# EAGLE design Esquemático_ppg (EAGLE 9.6.2)
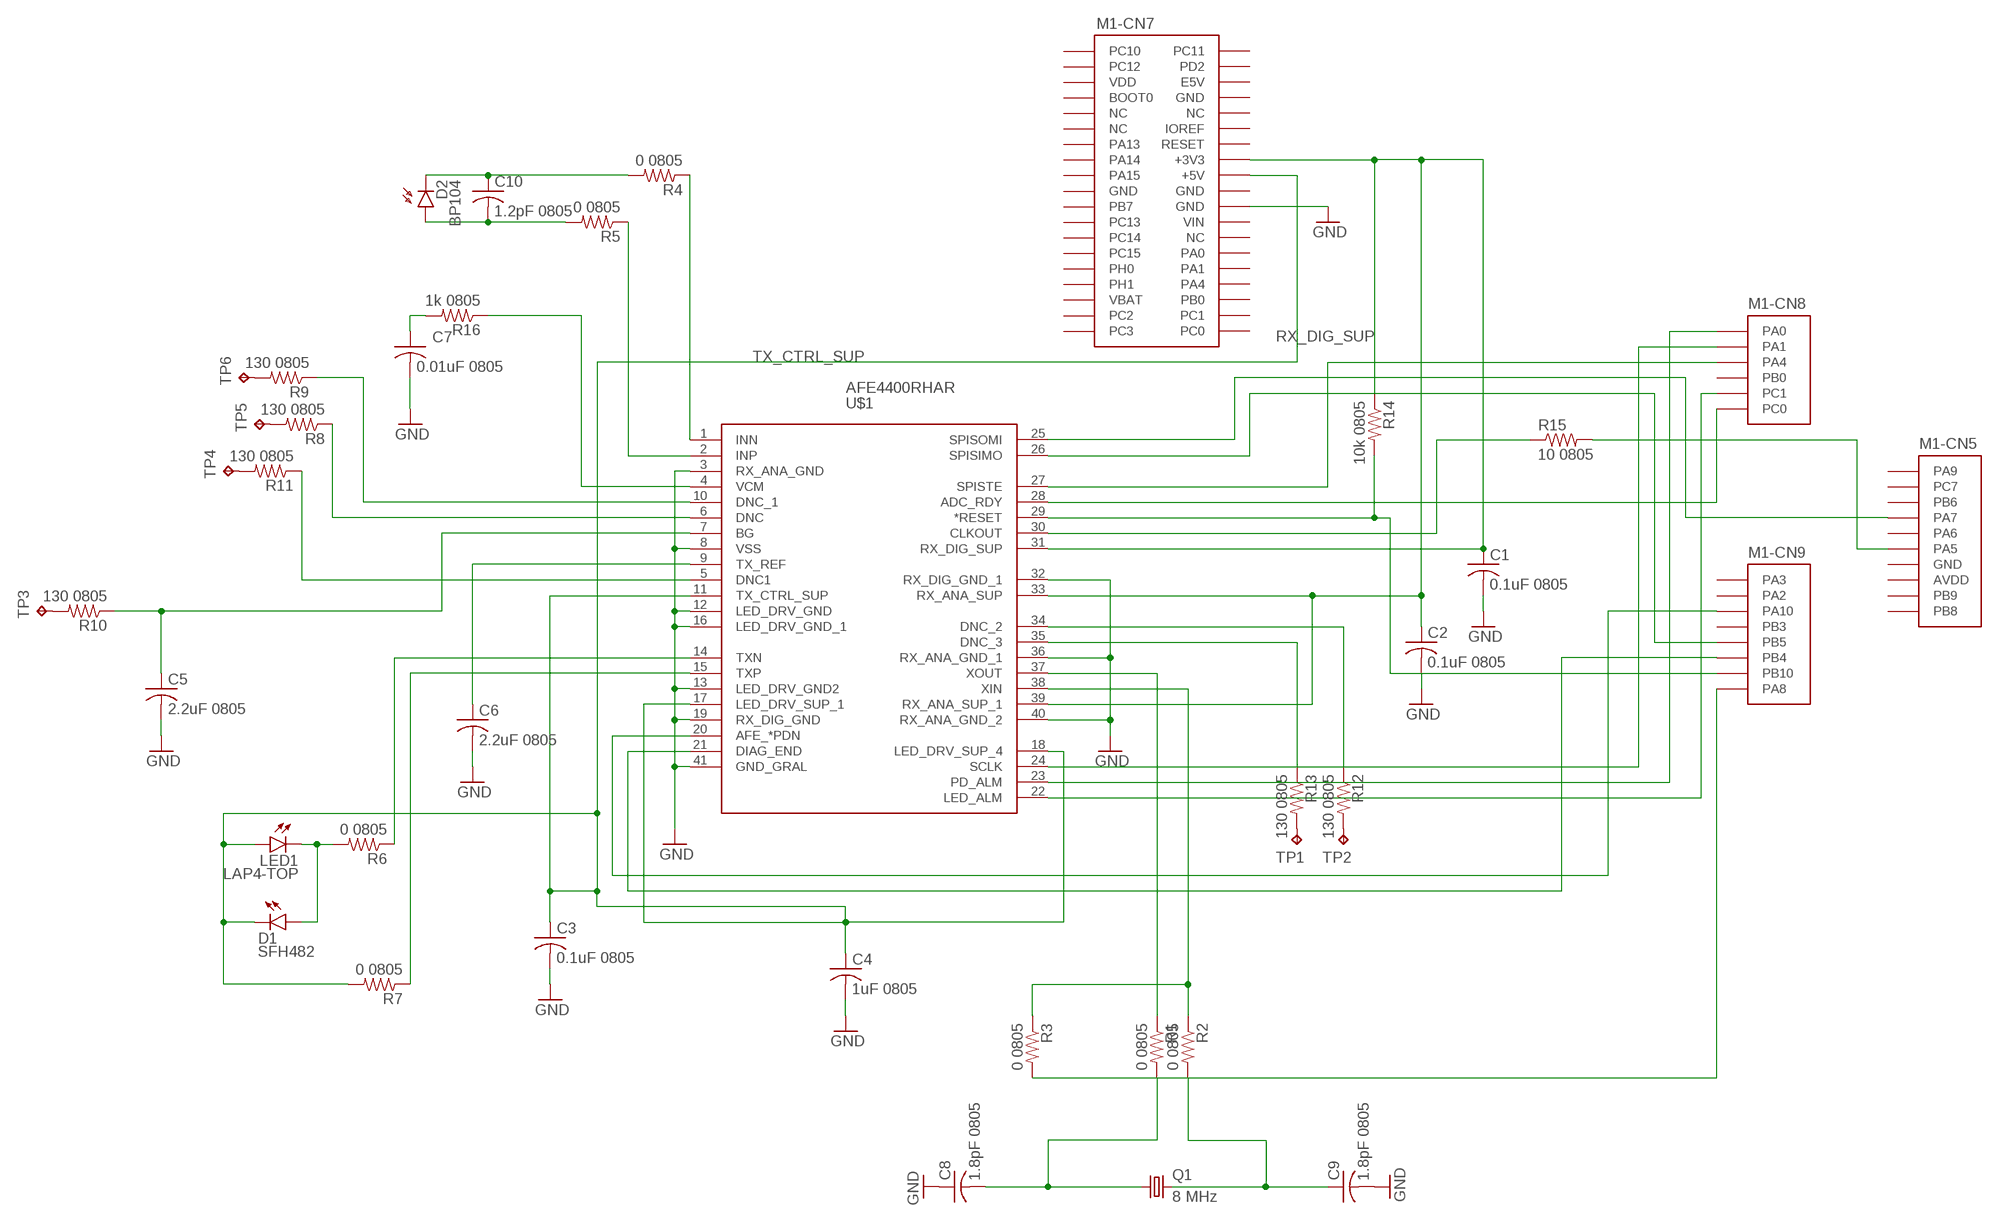
[diagram p0: schematic, sheet 1]

## Parts
C1  0.1uF 0805  C-USC0805  [C0805]
C2  0.1uF 0805  C-USC0805  [C0805]
C3  0.1uF 0805  C-USC0805  [C0805]
C4  1uF 0805  C-USC0805  [C0805]
C5  2.2uF 0805  C-USC0805  [C0805]
C6  2.2uF 0805  C-USC0805  [C0805]
C7  0.01uF 0805  C-USC0805  [C0805]
C8  1.8pF 0805  C-USC0805  [C0805]
C9  1.8pF 0805  C-USC0805  [C0805]
C10  1.2pF 0805  C-USC0805  [C0805]
D1  SFH482  [SFH482]
D2  BP104  [BP104]
LED1  LAP4-TOP  [P47F-TOP]
M1  NUCLEO-L452RE  [NUCLEO-64]
Q1  8 MHz  CRYSTALSM49  [SM49]
R1  0 0805  R-US_M0805  [M0805]
R2  0 0805  R-US_M0805  [M0805]
R3  0 0805  R-US_M0805  [M0805]
R4  0 0805  R-US_M0805  [M0805]
R5  0 0805  R-US_M0805  [M0805]
R6  0 0805  R-US_M0805  [M0805]
R7  0 0805  R-US_M0805  [M0805]
R8  130 0805  R-US_M0805  [M0805]
R9  130 0805  R-US_M0805  [M0805]
R10  130 0805  R-US_M0805  [M0805]
R11  130 0805  R-US_M0805  [M0805]
R12  130 0805  R-US_M0805  [M0805]
R13  130 0805  R-US_M0805  [M0805]
R14  10k 0805  R-US_M0805  [M0805]
R15  10 0805  R-US_M0805  [M0805]
R16  1k 0805  R-US_M0805  [M0805]
TP1  TPB1,27  [B1,27]
TP2  TPB1,27  [B1,27]
TP3  TPB1,27  [B1,27]
TP4  TPB1,27  [B1,27]
TP5  TPB1,27  [B1,27]
TP6  TPB1,27  [B1,27]
U$1  AFE4400RHAR  AFE4400  [40-VQFN(6X6)]

## Nets
GND: C1.2 C2.2 C3.2 C4.2 C5.2 C6.2 C7.2 C8.1 C9.2 M1.CN7-22(-CN7:GND) U$1.3(RX_ANA_GND) U$1.8(VSS) U$1.12(LED_DRV_GND) U$1.13(LED_DRV_GND2) U$1.16(LED_DRV_GND_1) U$1.19(RX_DIG_GND) U$1.32(RX_DIG_GND_1) U$1.36(RX_ANA_GND_1) U$1.40(RX_ANA_GND_2) U$1.41(GND_GRAL)
N$1: R4.1 U$1.1(INN)
N$2: R5.1 U$1.2(INP)
N$3: R6.1 U$1.14(TXN)
N$4: R7.1 U$1.15(TXP)
N$5: R2.1 R3.1 U$1.38(XIN)
N$6: R1.1 U$1.37(XOUT)
N$7: R13.2 TP1.TP
N$8: R12.2 TP2.TP
N$9: R10.2 TP3.TP
N$10: R11.1 U$1.5(DNC1)
N$11: R12.1 U$1.34(DNC_2)
N$12: R11.2 TP4.TP
N$13: R9.1 U$1.10(DNC_1)
N$14: R8.1 U$1.6(DNC)
N$15: C5.1 R10.1 U$1.7(BG)
N$16: R13.1 U$1.35(DNC_3)
N$17: M1.CN9-7(-CN9:PB10) R14.2 U$1.29(*RESET)
N$18: R8.2 TP5.TP
N$19: R15.1 U$1.30(CLKOUT)
N$20: M1.CN5-6(-CN5:PA5) R15.2
N$21: M1.CN9-8(-CN9:PA8) R3.2
N$22: M1.CN8-3(-CN8:PA4) U$1.27(SPISTE)
N$23: C6.1 U$1.9(TX_REF)
N$24: M1.CN9-5(-CN9:PB5) U$1.26(SPISIMO)
N$25: R16.1 U$1.4(VCM)
N$26: C7.1 R16.2
N$27: C8.2 Q1.1 R1.2
N$28: C9.1 Q1.2 R2.2
N$29: M1.CN5-4(-CN5:PA7) U$1.25(SPISOMI)
N$30: M1.CN8-1(-CN8:PA0) U$1.23(PD_ALM)
N$31: M1.CN8-5(-CN8:PC1) U$1.22(LED_ALM)
N$32: M1.CN8-6(-CN8:PC0) U$1.28(ADC_RDY)
N$33: M1.CN9-3(-CN9:PA10) U$1.20(AFE_*PDN)
N$34: M1.CN9-6(-CN9:PB4) U$1.21(DIAG_END)
N$35: D1.A LED1.C R6.2
N$36: R9.2 TP6.TP
N$37: C10.2 D2.A R5.2
N$38: C10.1 D2.K(C) R4.2
RX_DIG_SUP: C1.1 C2.1 M1.CN7-16(-CN7:+3V3) R14.1 U$1.31(RX_DIG_SUP) U$1.33(RX_ANA_SUP) U$1.39(RX_ANA_SUP_1)
SCLK: M1.CN8-2(-CN8:PA1) U$1.24(SCLK)
TX_CTRL_SUP: C3.1 C4.1 D1.K(C) LED1.A M1.CN7-18(-CN7:+5V) R7.2 U$1.11(TX_CTRL_SUP) U$1.17(LED_DRV_SUP_1) U$1.18(LED_DRV_SUP_4)
Unconnected: M1.CN5-1(-CN5:PA9) M1.CN5-2(-CN5:PC7) M1.CN5-3(-CN5:PB6) M1.CN5-5(-CN5:PA6) M1.CN5-9(-CN5:PB9) M1.CN5-10(-CN5:PB8) M1.CN6-1(-CN6:NC) M1.CN6-3(-CN6:RESET) M1.CN7-1(-CN7:PC10) M1.CN7-2(-CN7:PC11) M1.CN7-3(-CN7:PC12) M1.CN7-4(-CN7:PD2) M1.CN7-6(-CN7:E5V) M1.CN7-7(-CN7:BOOT0) M1.CN7-9(-CN7:NC) M1.CN7-10(-CN7:NC) M1.CN7-11(-CN7:NC) M1.CN7-12(-CN7:IOREF) M1.CN7-13(-CN7:PA13) M1.CN7-14(-CN7:RESET) M1.CN7-15(-CN7:PA14) M1.CN7-17(-CN7:PA15) M1.CN7-21(-CN7:PB7) M1.CN7-23(-CN7:PC13) M1.CN7-25(-CN7:PC14) M1.CN7-26(-CN7:NC) M1.CN7-27(-CN7:PC15) M1.CN7-28(-CN7:PA0) M1.CN7-29(-CN7:PH0) M1.CN7-30(-CN7:PA1) M1.CN7-31(-CN7:PH1) M1.CN7-32(-CN7:PA4) M1.CN7-34(-CN7:PB0) M1.CN7-35(-CN7:PC2) M1.CN7-36(-CN7:PC1) M1.CN7-37(-CN7:PC3) M1.CN7-38(-CN7:PC0) M1.CN8-4(-CN8:PB0) M1.CN9-1(-CN9:PA3) M1.CN9-2(-CN9:PA2) M1.CN9-4(-CN9:PB3) M1.CN10-1(-CN10:PC9) M1.CN10-2(-CN10:PC8) M1.CN10-3(-CN10:PB8) M1.CN10-4(-CN10:PC6) M1.CN10-5(-CN10:PB9) M1.CN10-6(-CN10:PC5) M1.CN10-10(-CN10:NC) M1.CN10-11(-CN10:PA5) M1.CN10-12(-CN10:PA12) M1.CN10-13(-CN10:PA6) M1.CN10-14(-CN10:PA11) M1.CN10-15(-CN10:PA7) M1.CN10-16(-CN10:PB12) M1.CN10-17(-CN10:PB6) M1.CN10-18(-CN10:PB11) M1.CN10-19(-CN10:PC7) M1.CN10-21(-CN10:PA9) M1.CN10-22(-CN10:PB2) M1.CN10-23(-CN10:PA8) M1.CN10-24(-CN10:PB1) M1.CN10-25(-CN10:PB10) M1.CN10-26(-CN10:PB15) M1.CN10-27(-CN10:PB4) M1.CN10-28(-CN10:PB14) M1.CN10-29(-CN10:PB5) M1.CN10-30(-CN10:PB13) M1.CN10-31(-CN10:PB3) M1.CN10-33(-CN10:PA10) M1.CN10-34(-CN10:PC4) M1.CN10-35(-CN10:PA2) M1.CN10-36(-CN10:NC) M1.CN10-37(-CN10:PA3) M1.CN10-38(-CN10:NC)

## Power pins joined to a net without a drawn wire
+3V3: M1.CN6-4(-CN6:+3V3)
+5V: M1.CN6-5(-CN6:+5V)
AGND: M1.CN10-32(-CN10:AGND)
AVDD: M1.CN5-8(-CN5:AVDD) M1.CN10-7(-CN10:AVDD)
GND: M1.CN5-7(-CN5:GND) M1.CN6-6(-CN6:GND) M1.CN6-7(-CN6:GND) M1.CN7-8(-CN7:GND) M1.CN7-19(-CN7:GND) M1.CN7-20(-CN7:GND) M1.CN10-9(-CN10:GND) M1.CN10-20(-CN10:GND)
IOREF: M1.CN6-2(-CN6:IOREF)
U5V: M1.CN10-8(-CN10:U5V)
VBAT: M1.CN7-33(-CN7:VBAT)
VDD: M1.CN7-5(-CN7:VDD)
VIN: M1.CN6-8(-CN6:VIN) M1.CN7-24(-CN7:VIN)

## Library data of the parts
C1-C4 = rcl:C-US: CAPACITOR, American symbol; PARTNO: GRM188R72A104KA35J; SPICEPREFIX: C
C5 C6 = rcl:C-US: CAPACITOR, American symbol; PARTNO: GRM21BR71E225KE11L; SPICEPREFIX: C
C7 = rcl:C-US: CAPACITOR, American symbol; PARTNO: GRM2195C1H103JA01D; SPICEPREFIX: C
C8 C9 = rcl:C-US: CAPACITOR, American symbol; PARTNO: 600F180FT250XT; SPICEPREFIX: C
C10 = rcl:C-US: CAPACITOR, American symbol; PARTNO: GQM2195C2E1R2BB12D; SPICEPREFIX: C
D1 = led:SFH482: IR LED infrared emitting diode, Infineon; PARTNO: SCM-013RT
D2 = opto-trans-siemens:BP104: PHOTO DIODE; MF: VISHAY/TELEFUNKEN; MPN: BP104; OC_FARNELL: 1779636; OC_NEWARK: 14M4504; PARTNO: VEMD2020X01
LED1 = led:*P4: PointLED® Enhanced Thinfilm LED TOP & BOTTOM mount LS P47F, LR P47F, LA P47F, LY P47F, LT P4SG, LB P4SG, LW P4SG Source: http://catalog.osram-os.com .. LA_LR_LS_LY_P47F_Pb_free.pdf; PARTNO: HLMP-K150
M1 = NUCLEO-L452RE:NUCLEO-L452RE: No existe un outline (Layer Dimension) para esta librería. En su lugar se utilizó una referencia en tDocu. Al momento de diseñar la tarjeta, el Dimension debe ser dibujado según los requerimientos del usuario, o simplemente copiar los contenidos del tDocu en Dimensions.
Q1 = crystal:CRYSTAL: CRYSTAL; OC_FARNELL: unknown; OC_NEWARK: unknown; PARTNO: ABLS-8.000MHZ-B4-T
R1-R7 = rcl:R-US_: RESISTOR, American symbol; PARTNO: RMCF0805ZT0R00; SPICEPREFIX: R
R8-R13 = rcl:R-US_: RESISTOR, American symbol; PARTNO: RMCF0805FT130R; SPICEPREFIX: R
R14 = rcl:R-US_: RESISTOR, American symbol; PARTNO: RC0805FR-1010KL; SPICEPREFIX: R
R15 = rcl:R-US_: RESISTOR, American symbol; PARTNO: RC0805FR-0710RL; SPICEPREFIX: R
R16 = rcl:R-US_: RESISTOR, American symbol; PARTNO: RMCF0805FT1K00; SPICEPREFIX: R
TP1-TP6 = testpad:TP: Test pad
U$1 = AFE4400RHAR - TI:AFE4400

## Board
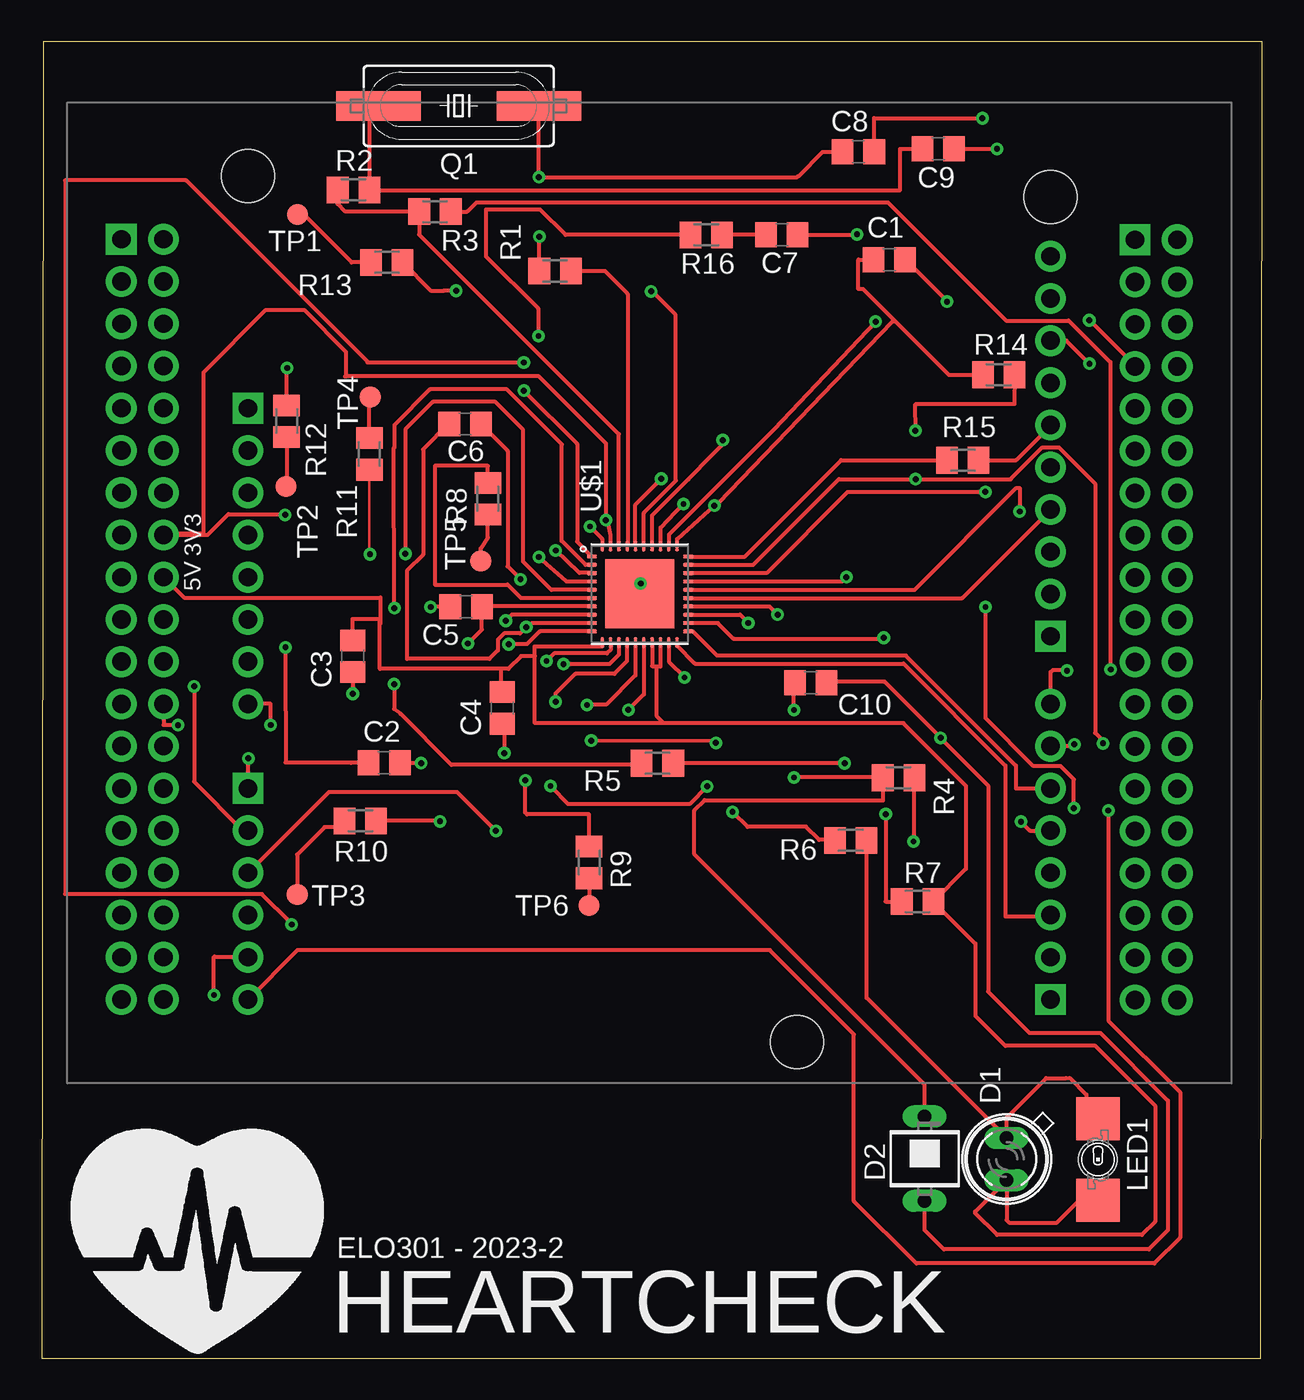
[diagram p1: board, top side]
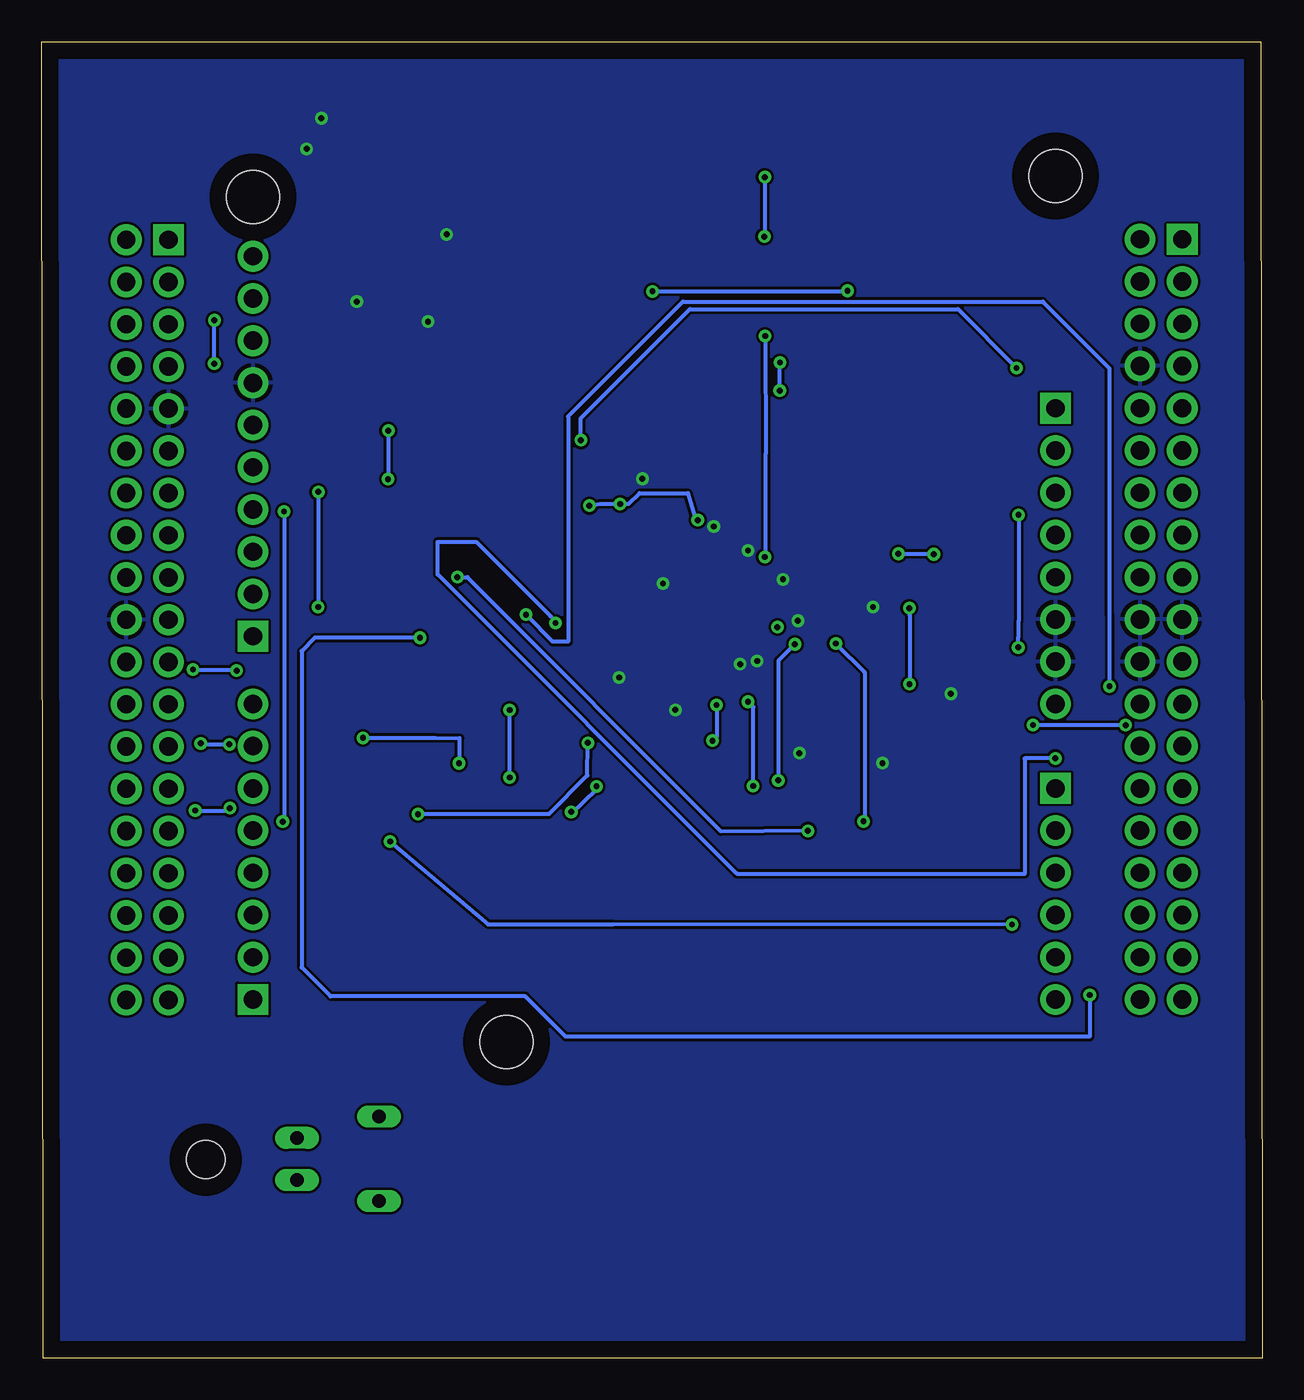
[diagram p2: board, bottom side, seen from below]

Size 73.4 x 79.19 mm. Coordinates in mm from the lower left corner, seen from the top.
Outline: 0,0 73.31,0.03 73.4,79.19 0.09,79.17 0,0
Copper layers (1*16): Top 0.035mm / dielectric 1.5mm / Bottom 0.035mm
Design rules "default *": minimum track width 6mil, minimum drill 0.3mm, track to track 6mil, track to pad 6mil, pad to pad 6mil, via to via 6mil, smd to smd 6mil, copper to edge 40mil, drill to drill 6mil, minimum pad ring 10mil, minimum via ring 8mil, stop-mask expansion 2mil, vias tented up to drill 0.5mm, thermal gap 10mil

### Footprints (pad centres in the part's own frame; a part is rotated, then mirrored left to right if it is on the bottom)
C0805 = smd 1.3 x 1.5: 1 -0.95,0; 2 0.95,0
SFH482 = drill 0.813 long: A -1.27,0; K 1.27,0
BP104 = drill 0.813 long: A 0,2.54; K 0,-2.54
P47F-TOP = smd 2.6 x 2.6: A -2.45,0; C 2.45,0 | hole 2.3: 0,0
NUCLEO-64 = drill 1.1 pad 1.85 square: CN5-1 59.13,24.884; CN6-1 10.87,38.6; CN7-1 3.25,48.76; CN8-1 10.87,15.74; CN9-1 59.13,3.04; CN10-1 64.21,48.735 | drill 1.1 pad 1.85: CN5-2 59.13,27.424; CN5-3 59.13,29.964; CN5-4 59.13,32.504; CN5-5 59.13,35.044; CN5-6 59.13,37.584; CN5-7 59.13,40.124; CN5-8 59.13,42.664; CN5-9 59.13,45.204; CN5-10 59.13,47.744; CN6-2 10.87,36.06; CN6-3 10.87,33.52; CN6-4 10.87,30.98; CN6-5 10.87,28.44; CN6-6 10.87,25.9; CN6-7 10.87,23.36; CN6-8 10.87,20.82; CN7-2 5.79,48.76; CN7-3 3.25,46.22; CN7-4 5.79,46.22; CN7-5 3.25,43.68; CN7-6 5.79,43.68; CN7-7 3.25,41.14; CN7-8 5.79,41.14; CN7-9 3.25,38.6; CN7-10 5.79,38.6; CN7-11 3.25,36.06; CN7-12 5.79,36.06; CN7-13 3.25,33.52; CN7-14 5.79,33.52; CN7-15 3.25,30.98; CN7-16 5.79,30.98; CN7-17 3.25,28.44; CN7-18 5.79,28.44; CN7-19 3.25,25.9; CN7-20 5.79,25.9; CN7-21 3.25,23.36; CN7-22 5.79,23.36; CN7-23 3.25,20.82; CN7-24 5.79,20.82; CN7-25 3.25,18.28; CN7-26 5.79,18.28; CN7-27 3.25,15.74; CN7-28 5.79,15.74; CN7-29 3.25,13.2; CN7-30 5.79,13.2; CN7-31 3.25,10.66; CN7-32 5.79,10.66; CN7-33 3.25,8.12; CN7-34 5.79,8.12; CN7-35 3.25,5.58; CN7-36 5.79,5.58; CN7-37 3.25,3.04; CN7-38 5.79,3.04; CN8-2 10.87,13.2; CN8-3 10.87,10.66; CN8-4 10.87,8.12; CN8-5 10.87,5.58; CN8-6 10.87,3.04; CN9-2 59.13,5.58; CN9-3 59.13,8.12; CN9-4 59.13,10.66; CN9-5 59.13,13.2; CN9-6 59.13,15.74; CN9-7 59.13,18.28; CN9-8 59.13,20.82; CN10-2 66.75,48.735; CN10-3 64.21,46.195; CN10-4 66.75,46.195; CN10-5 64.21,43.655; CN10-6 66.75,43.655; CN10-7 64.21,41.115; CN10-8 66.75,41.115; CN10-9 64.21,38.575; CN10-10 66.75,38.575; CN10-11 64.21,36.035; CN10-12 66.75,36.035; CN10-13 64.21,33.495; CN10-14 66.75,33.495; CN10-15 64.21,30.955; CN10-16 66.75,30.955; CN10-17 64.21,28.415; CN10-18 66.75,28.415; CN10-19 64.21,25.875; CN10-20 66.75,25.875; CN10-21 64.21,23.335; CN10-22 66.75,23.335; CN10-23 64.21,20.795; CN10-24 66.75,20.795; CN10-25 64.21,18.255; CN10-26 66.75,18.255; CN10-27 64.21,15.715; CN10-28 66.75,15.715; CN10-29 64.21,13.175; CN10-30 66.75,13.175; CN10-31 64.21,10.635; CN10-32 66.75,10.635; CN10-33 64.21,8.095; CN10-34 66.75,8.095; CN10-35 64.21,5.555; CN10-36 66.75,5.555; CN10-37 64.21,3.015; CN10-38 66.75,3.015 | hole 3.175: 59.13,51.3; 10.87,52.57; 43.89,0.5
SM49 = smd 5.08 x 1.778: 1 -4.826,0; 2 4.826,0
M0805 = smd 1.3 x 1.6: 1 -0.95,0; 2 0.95,0
B1,27 = smd 1.27 x 1.27: TP 0,0
40-VQFN(6X6) = smd 0.6 x 0.22: 1 -2.875,2.25; 2 -2.875,1.75; 3 -2.875,1.25; 4 -2.875,0.75; 5 -2.875,0.25; 6 -2.875,-0.25; 7 -2.875,-0.75; 8 -2.875,-1.25; 9 -2.875,-1.75; 10 -2.875,-2.25; 21 2.925,-2.25; 22 2.925,-1.75; 23 2.925,-1.25; 24 2.925,-0.75; 25 2.925,-0.25; 26 2.925,0.25; 27 2.925,0.75; 28 2.925,1.25; 29 2.925,1.75; 30 2.925,2.25 | smd 0.22 x 0.6: 11 -2.25,-2.925; 12 -1.75,-2.925; 13 -1.25,-2.925; 14 -0.75,-2.925; 15 -0.25,-2.925; 16 0.25,-2.925; 17 0.75,-2.925; 18 1.25,-2.925; 19 1.75,-2.925; 20 2.25,-2.925; 31 2.25,2.875; 32 1.75,2.875; 33 1.25,2.875; 34 0.75,2.875; 35 0.25,2.875; 36 -0.25,2.875; 37 -0.75,2.875; 38 -1.25,2.875; 39 -1.75,2.875; 40 -2.25,2.875 | smd 4.15 x 4.15: 41 0,0

### Placement (x,y rotation side)
C1  50.98,66.07 0 top
C2  20.6,35.81 0 top
C3  18.71,42.23 270 top
C4  27.71,39.12 270 top
C5  25.53,45.22 180 top
C6  25.47,56.19 0 top
C7  44.52,67.58 0 top
C8  49.12,72.55 180 top
C9  53.92,72.73 0 top
C10  46.25,40.64 0 top
D1  58.04,11.99 270 top
D2  53.11,12.01 180 top
LED1  63.53,11.96 90 top
M1  1.55,18.54 0 top
Q1  25.08,75.32 180 top
R1  30.88,65.4 180 top
R2  18.76,70.27 0 top
R3  23.66,68.97 0 top
R4  51.54,34.92 180 top
R5  37.04,35.79 0 top
R6  48.66,31.15 0 top
R7  52.68,27.48 0 top
R8  26.84,51.7 270 top
R9  32.93,29.83 270 top
R10  19.17,32.33 180 top
R11  19.72,54.39 90 top
R12  14.74,56.36 270 top
R13  20.77,65.91 180 top
R14  57.56,59.15 0 top
R15  55.4,54.01 0 top
R16  39.97,67.56 0 top
TP1  15.4,68.8 0 top
TP2  14.71,52.43 0 top
TP3  15.38,27.89 0 top
TP4  19.77,57.81 0 top
TP5  26.41,47.95 270 top
TP6  32.92,27.23 0 top
U$1  35.97,45.97 0 top

### Tracks (layer width: path | path; a pad name or v marks a point on that pad's centre or on a via)
AVDD  (via drill 0.35)
  Top 0.254: v63.01,62.43 v63.01,62.44 63,62.46 63,62.47 65.76,59.71 M1.CN10-7 | M1.CN5-8 61.63,61.21 v63.02,59.82
  Bottom 0.254: v63.02,59.82 v63.01,62.43
GND  (via drill 0.35)
  Top 0.254: v50.16,62.35 44.01,55.83 37.72,49.54 U$1.32 | U$1.41 35.97,46.54 v36.03,46.6 | U$1.36 35.72,51.35 v37.27,52.9 | v32.98,50.03 33.72,49.29 U$1.40 | U$1.3 33.08,47.24 32.35,47.24 v30.92,48.59 | U$1.8 28.28,44.72 v27.92,44.36 | U$1.12 34.22,42.62 34,42.4 30.83,42.4 v30.37,41.94 | U$1.13 34.72,42.32 34.15,41.75 v31.39,41.75 | U$1.16 36.22,39.93 v35.29,39 | U$1.19 37.72,41.9 v38.67,40.95 | C5.2 23.39,45.22 v23.39,45.19 v23.4,45.19 | C6.2 28.03,54.58 28.03,47.63 v28.81,46.85 v28.82,46.84 | C3.2 18.71,40.06 18.72,40.06 v18.72,39.97 | C7.2 48.74,67.58 48.9,67.47 49.01,67.6 v49.04,67.6 | v54.45,63.55 54.45,63.59 51.97,66.07 C1.2 | C9.2 v57.45,72.73 v57.46,72.74 | C8.1 50.07,74.58 v56.58,74.58 | C2.2 22.81,35.81 v22.83,35.8 | C4.2 27.83,38.05 v27.83,36.4
  pour Bottom: 0.03,0 73.18,0 73.18,79.14 0.03,79.14
N$1  (via drill 0.35)
  Top 0.254: U$1.1 32.2,49.11 32.2,55 v29.01,58.2 | v15.04,26.09 14.99,26.19 13.26,27.92 1.42,27.92 1.42,70.84 8.69,70.84 19.6,59.92 19.61,59.89 v29,59.89 | v52.44,31.09 52.44,34.75 R4.1
  Bottom 0.254: v29.01,58.2 29.01,59.9 v29,59.89 | v15.04,26.09 39.04,26.1 46.54,26.1 52.42,31.06 v52.44,31.09
N$2  (via drill 0.35)
  Top 0.254: R5.1 36,35.7 24.65,35.7 21.59,38.76 21.22,39.05 21.21,39.04 v21.21,40.55 21.21,40.38 | 21.22,54.85 21.22,54.79 | v21.22,45.12 21.19,54.77 21.22,54.79 | 32.93,47.7 33.07,47.7 U$1.2 32.71,47.72 31.28,49.16 31.28,54.92 31.31,54.95 27.99,58.27 23.36,58.27 21.22,56.13 21.22,54.79
  Bottom 0.254: v21.21,40.55 21.2,40.58 21.2,44.71 v21.22,45.12
N$3  (via drill 0.35)
  Top 0.254: R6.1 47.68,31.18 46.76,31.18 45.97,31.98 42.46,31.96 v41.55,32.87 | v40.03,34.4 38.97,33.34 33.01,33.34 31.69,33.34 v30.61,34.42 | v30.92,39.49 30.92,39.99 32.1,41.17 34.45,41.17 35.22,41.94 U$1.14
  Bottom 0.254: v41.55,32.87 41.55,32.76 40.03,34.23 v40.03,34.4 | v30.61,34.42 30.6,39.17 v30.92,39.49
N$4  (via drill 0.35)
  Top 0.254: U$1.15 35.72,41.08 33.96,39.32 32.81,39.32 v32.81,39.29 | v33.06,37.15 v33.07,37.14 40.41,37.13 40.51,37.02 v40.55,37.02 | v50.77,32.73 50.77,27.48 R7.1
  Bottom 0.254: v32.81,39.29 32.81,37.4 v33.06,37.15 | v40.55,37.02 40.56,37 40.58,35.06 42.91,32.73 v50.77,32.73
N$5
  Top 0.254: R2.1 17.81,69.43 18.27,68.97 R3.1 22.71,67.59 34.72,55.58 U$1.38
N$6
  Top 0.254: R1.1 33.86,65.4 35.24,64.02 35.24,48.87 U$1.37
N$7
  Top 0.254: R13.2 18.65,65.91 15.76,68.8 TP1.TP
N$8
  Top 0.254: TP2.TP 14.74,52.46 R12.2
N$9
  Top 0.254: R10.2 17.84,31.95 17.03,31.95 15.38,30.3 TP3.TP
N$10  (via drill 0.35)
  Top 0.152: R11.1 19.72,48.39 v19.75,48.36
  Top 0.254: U$1.5 30.66,46.22 28.97,47.92 28.97,55.84 27.29,57.52 23.53,57.52 21.88,55.87 21.88,49.26 v21.87,48.39 | R11.1
  Bottom 0.254: v21.87,48.39 19.78,48.39 v19.75,48.36
N$11  (via drill 0.35)
  Top 0.254: U$1.34 36.72,50.69 38.9,52.87 40.33,54.33 40.97,54.97 v40.97,55.22 | v14.77,59.56 14.82,59.52 14.74,59.44 R12.1
  Bottom 0.254: v40.97,55.22 40.97,56.55 34.41,63.1 18.29,63.1 18.29,63.08 v14.77,59.56
N$12
  Top 0.254: R11.2 19.72,57.73 19.72,57.77 TP4.TP
N$13  (via drill 0.35)
  Top 0.254: U$1.10 29.96,43.72 29.19,42.95 v28.1,42.95 | R9.1 32.92,32.72 29.21,32.72 29.09,32.84 v29.09,34.76 v29.1,34.76
  Bottom 0.254: v28.1,42.95 29.1,41.95 v29.1,34.76
N$14
  Top 0.254: U$1.6 28.83,45.72 28.03,46.53 23.66,46.53 23.66,53.68 26.84,53.68 R8.1
N$15  (via drill 0.35)
  Top 0.254: U$1.7 33.08,45.23 26.5,45.23 C5.1 26.48,43.83 v25.64,42.99 | v23.97,32.3 23.95,32.3 23.92,32.33 R10.1
  Bottom 0.254: v23.97,32.3 23.9,32.37 23.9,41.25 v25.64,42.99
N$16  (via drill 0.35)
  Top 0.254: U$1.35 36.22,50.85 38.15,52.78 38.14,62.75 36.74,64.17 v36.66,64.17 | v24.93,64.21 24.19,64.21 24.18,64.19 23.44,64.19 R13.1
  Bottom 0.254: v36.66,64.17 24.93,64.19 v24.93,64.21
N$17  (via drill 0.35)
  Top 0.254: U$1.29 42.79,47.72 47.95,52.88 v52.57,52.88 58.3,52.88 58.29,52.9 60.18,54.79 61.18,54.79 63.36,52.61 63.36,37.61 63.88,37.1 63.88,37.04 v63.83,36.99 | R14.2 58.5,57.39 52.55,57.37 52.56,55.8 v52.55,55.79 | v62.11,36.93 62,36.82 M1.CN9-7
  Bottom 0.254: v52.55,55.79 52.55,52.99 v52.57,52.88 | v63.83,36.99 63.77,36.93 v62.11,36.93
N$18
  Top 0.254: TP5.TP 26.41,48.7 26.86,49.38 26.84,49.36 R8.2
N$19
  Top 0.254: U$1.30 42.29,48.22 48.08,54.01 R15.1
N$20
  Top 0.254: R15.2 58.61,54.01 60.68,56.08 M1.CN5-6
N$21  (via drill 0.35)
  Top 0.254: M1.CN9-8 60.68,41.27 60.79,41.38 61.65,41.38 v61.67,41.36 | v64.29,41.42 64.29,59.93 64.26,59.92 61.77,62.41 58.01,62.41 50.89,69.53 26.16,69.53 25.6,68.97 R3.2
  Bottom 0.254: v61.67,41.36 61.72,41.41 64.2,41.41 64.21,41.42 v64.29,41.42
N$22  (via drill 0.35)
  Top 0.254: U$1.27 48.14,46.72 v48.4,46.98 | v27.32,31.73 24.99,34.06 17.28,34.06 M1.CN8-3
  Bottom 0.254: v48.4,46.98 47.79,46.98 32.57,31.71 27.34,31.75 v27.32,31.73
N$23  (via drill 0.35)
  Top 0.254: U$1.9 33.08,44.21 29.5,44.21 v29.15,43.99 v29.15,43.98 28.78,43.61 27.82,43.61 27.44,43.22 27.44,42.58 26.93,42.07 21.97,42.07 21.97,47.36 22.94,48.33 22.94,54.66 24.47,56.19 C6.1
N$24  (via drill 0.35)
  Top 0.254: U$1.26 52.5,46.22 58.63,52.35 58.82,52.35 v58.82,50.93 | v58.9,32.28 59.43,31.74 M1.CN9-5
  Bottom 0.254: v58.82,50.93 58.82,32.36 v58.9,32.28
N$25  (via drill 0.35)
  Top 0.254: R16.1 31.51,67.56 29.99,69.09 26.72,69.09 26.72,66.28 29.86,63.14 29.86,61.52 v29.89,61.49 | v29.91,48.19 31.56,46.72 U$1.4
  Bottom 0.254: v29.89,61.49 29.84,54.47 29.84,54.42 29.85,48.19 v29.91,48.19
N$26
  Top 0.254: C7.1 43.24,67.56 R16.2
N$27  (via drill 0.35)
  Top 0.254: R1.2 29.92,67.47 v29.94,67.46 | Q1.1 v29.91,71.04 45.44,71.04 45.47,71.07 45.5,71.07 46.97,72.55 C8.2
  Bottom 0.254: v29.94,67.46 29.9,67.5 29.9,70.96 29.95,71.01 v29.91,71.04
N$28
  Top 0.254: Q1.2 19.71,74.78 R2.2 19.73,70.25 51.63,70.25 51.63,72.73 C9.1
N$29
  Top 0.254: U$1.25 55.36,45.72 M1.CN5-4
N$30  (via drill 0.35)
  Top 0.254: M1.CN8-1 12.42,35.78 12.44,35.91 v12.44,36.09 | U$1.23 42,44.72 v42.5,44.23
  Bottom 0.254: v12.44,36.09 14.28,36.09 14.28,29.13 14.31,29.16 31.59,29.16 49.58,47.15 49.58,49.1 47.27,49.1 42.79,44.62 v42.5,44.23
N$31  (via drill 0.35)
  Top 0.254: U$1.22 40.67,44.21 41.6,43.29 50.65,43.29 v50.65,43.34 | v10.37,21.85 10.37,24.15 10.4,24.17 12.37,24.17 M1.CN8-5
  Bottom 0.254: v50.65,43.34 56.97,43.34 57.77,42.54 57.77,23.52 56.02,21.77 44.31,21.77 41.89,19.35 10.37,19.35 v10.37,21.85
N$32  (via drill 0.35)
  Top 0.254: v64.16,32.95 64.16,20.32 68.47,16.01 68.47,7.26 66.92,5.71 52.61,5.71 48.86,9.46 48.86,19.49 43.79,24.55 15.39,24.55 M1.CN8-6 | v62.08,33.09 62.08,34.82 61.28,35.62 59.65,35.62 56.77,38.5 v56.77,45.19 | v56.76,52.11 56.74,52.09 48.46,52.09 43.6,47.23 U$1.28
  Bottom 0.254: v64.16,32.95 62.22,32.95 v62.08,33.09 | v56.77,45.19 v56.76,45.2 v56.76,52.11
N$33
  Top 0.254: U$1.20 38.22,42.85 39.29,41.78 51.84,41.78 57.97,35.65 57.97,26.59 60.61,26.59 M1.CN9-3
N$34
  Top 0.254: U$1.21 39.16,43.72 40.62,42.26 51.98,42.26 58.6,35.65 58.6,34.28 M1.CN9-6
N$35
  Top 0.152: 62.75,14.74 63.08,14.41 LED1.C
  Top 0.254: R6.2 49.61,21.69 D1.A 58.04,14.48 60.41,16.85 61.62,16.85 61.82,16.88 62.84,15.87 62.84,14.82 62.75,14.74
N$36
  Top 0.254: R9.2 32.93,27.23 TP6.TP
N$37  (via drill 0.35)
  Top 0.254: C10.2 47.26,40.7 50.71,40.7 50.71,40.68 v54.07,37.32 54.07,37.3 56.92,34.45 56.92,22.06 59.4,19.57 63.66,19.57 67.74,15.5 67.74,7.71 66.59,6.56 54.27,6.56 53.11,7.72 D2.A | v48.3,35.79 R5.2
  Bottom 0.254: v54.07,37.32 49.72,37.32 48.26,37.31 48.28,37.26 48.28,35.81 v48.3,35.79
N$38  (via drill 0.35)
  Top 0.254: D2.K 53.11,16.46 39.26,30.32 39.26,32.96 39.87,33.57 50.59,33.56 R4.2 50.59,34.94 v45.25,34.94 | v45.25,38.99 45.25,40.58 C10.1
  Bottom 0.254: 45.25,34.86 v45.25,34.94 v45.25,38.99
RX_DIG_SUP  (via drill 0.35)
  Top 0.254: U$1.39 34.22,49.51 34.08,50.27 v33.94,50.41 33.94,55.02 29.9,59.06 18.31,59.06 | U$1.33 37.23,48.86 37.23,49.96 v38.6,51.39 | U$1.31 38.22,49.26 v40.46,51.27 v40.46,51.28 40.68,51.4 51.16,62.34 51.36,62.35 | C1.1 49.12,66.08 49.12,64.3 49.41,64.3 51.36,62.35 | C2.1 18.61,35.81 14.68,35.83 14.66,42.05 v14.66,42.76 v14.67,42.76 | 18.31,59.06 18.25,59.06 | v14.65,50.73 14.65,50.77 14.64,50.76 14.17,50.76 11.23,50.77 9.99,49.52 M1.CN7-16 7.41,49.59 9.67,49.59 9.75,49.66 9.75,59.26 9.73,59.28 13.5,63.05 15.79,63.05 18.31,60.53 18.31,59.06 | 56.52,59.06 R14.1 54.56,59.15 51.36,62.35
  Bottom 0.254: v33.94,50.41 34.03,50.32 34.53,52.04 37.44,52.04 38.09,51.39 v38.6,51.39 38.61,51.4 39.82,51.4 v40.46,51.28 | v14.65,50.73 14.65,44.34 14.66,44.3 14.66,43.39 v14.67,42.76
SCLK  (via drill 0.35)
  Top 0.254: U$1.24 43.77,45.22 v44.27,44.73 | M1.CN8-2 12.11,31.74 9.17,34.68 v9.18,40.42
  Bottom 0.254: v44.27,44.73 42.65,43.11 41.73,43.11 41.73,56.65 34.83,63.55 13.19,63.55 9.18,59.54 9.18,44.72 v9.18,40.42
TX_CTRL_SUP
  Top 0.254: U$1.11 33.72,42.81 29.66,42.81 29.66,42.24 | 29.66,42.24 29.67,42.24 29.67,38.2 37.43,38.2 | 29.66,42.24 28.84,42.24 28.07,41.47 27.6,41.47 | 27.6,41.47 20.35,41.47 20.35,44.2 | 20.35,44.2 20.35,44.48 18.7,44.48 18.7,43.2 C3.1 | 20.35,44.2 20.38,44.2 20.38,45.75 8.57,45.75 M1.CN7-18 | 27.6,41.47 27.6,40.18 C4.1 | 37.43,38.2 51.83,38.2 55.59,34.44 55.59,29.44 R7.2 56.16,24.95 56.16,20.61 57.97,18.8 63.37,18.8 66.97,15.2 66.97,8.22 66.17,7.43 57.46,7.43 56.15,8.74 56.15,8.83 D1.K | U$1.18 37.22,41.6 36.97,41.6 | 36.97,41.6 36.97,38.66 37.43,38.2 | U$1.17 36.72,41.65 36.77,41.6 36.97,41.6 | 58.22,10.55 D1.K | D1.K 58.04,8.32 58.19,8.17 61.06,8.17 62.41,9.51 LED1.A
VIN  (via drill 0.35)
  Top 0.254: v8.21,38.08 7.34,38.08 M1.CN7-24 | v13.78,38.09 13.78,39.36 M1.CN6-8
  Bottom 0.254: v8.21,38.08 v13.77,38.08 v13.78,38.09

### Text on the board
tNames: 3V3 | 5V | ELO301 - 2023-2 | HEARTCHECK
tDocu: Solder Layer Colour: Purple